# EAGLE schematic outin_shield_arduino (EAGLE 7.4.0)
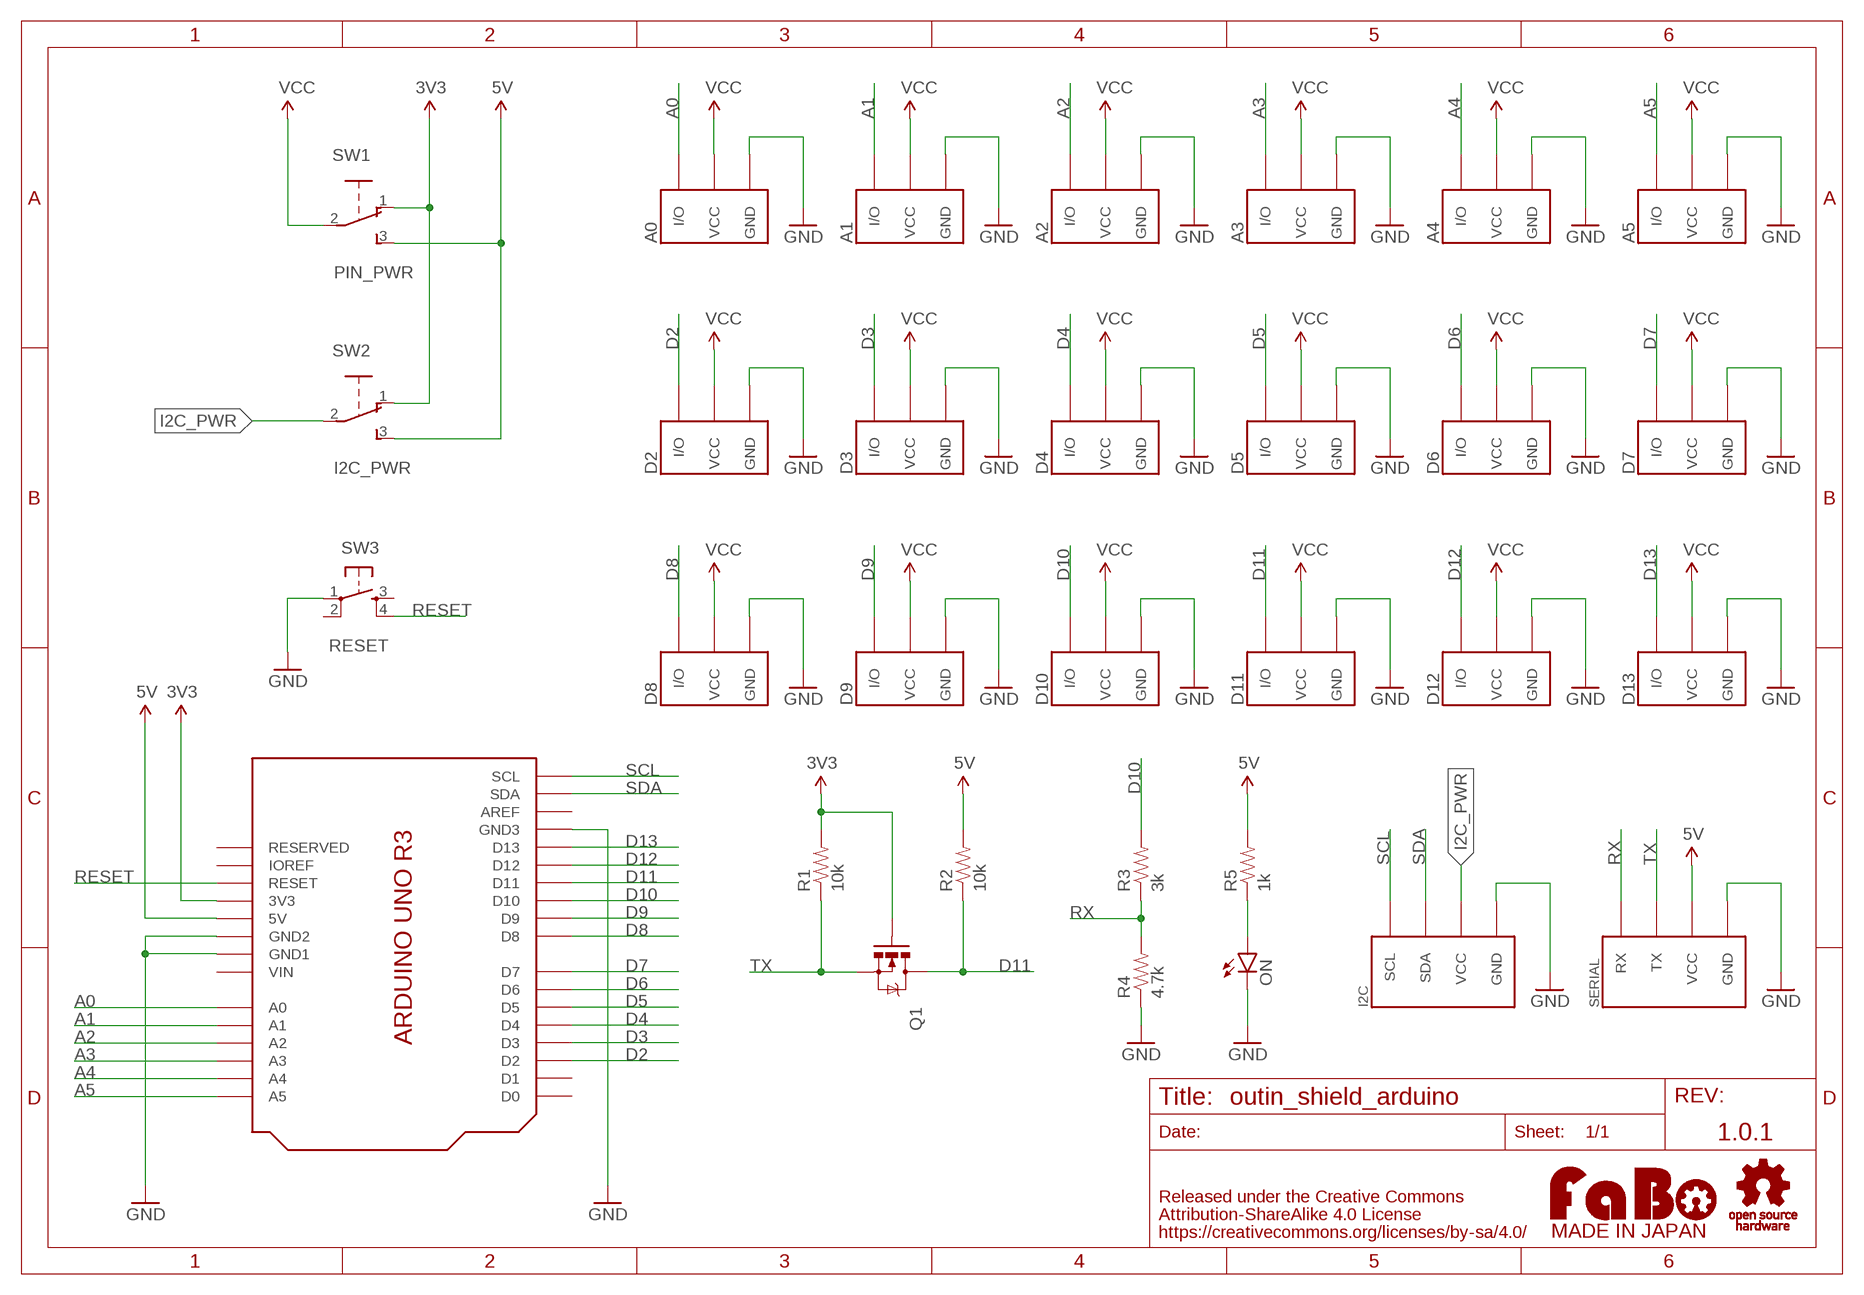
[diagram p0: schematic, sheet 1]

## Parts
A0  FABO_BRICK_3PIN-CONNECTOR  [FABO_BRICK_3PIN_CONNECTOR]
A1  FABO_BRICK_3PIN-CONNECTOR  [FABO_BRICK_3PIN_CONNECTOR]
A2  FABO_BRICK_3PIN-CONNECTOR  [FABO_BRICK_3PIN_CONNECTOR]
A3  FABO_BRICK_3PIN-CONNECTOR  [FABO_BRICK_3PIN_CONNECTOR]
A4  FABO_BRICK_3PIN-CONNECTOR  [FABO_BRICK_3PIN_CONNECTOR]
A5  FABO_BRICK_3PIN-CONNECTOR  [FABO_BRICK_3PIN_CONNECTOR]
D2  FABO_BRICK_3PIN-HEADER  [FABO_BRICK_3PIN_HEADER]
D3  FABO_BRICK_3PIN-HEADER  [FABO_BRICK_3PIN_HEADER]
D4  FABO_BRICK_3PIN-HEADER  [FABO_BRICK_3PIN_HEADER]
D5  FABO_BRICK_3PIN-HEADER  [FABO_BRICK_3PIN_HEADER]
D6  FABO_BRICK_3PIN-HEADER  [FABO_BRICK_3PIN_HEADER]
D7  FABO_BRICK_3PIN-HEADER  [FABO_BRICK_3PIN_HEADER]
D8  FABO_BRICK_3PIN-HEADER  [FABO_BRICK_3PIN_HEADER]
D9  FABO_BRICK_3PIN-HEADER  [FABO_BRICK_3PIN_HEADER]
D10  FABO_BRICK_3PIN-HEADER  [FABO_BRICK_3PIN_HEADER]
D11  FABO_BRICK_3PIN-HEADER  [FABO_BRICK_3PIN_HEADER]
D12  FABO_BRICK_3PIN-HEADER  [FABO_BRICK_3PIN_HEADER]
D13  FABO_BRICK_3PIN-HEADER  [FABO_BRICK_3PIN_HEADER]
I2C  FABO_BRICK_I2C-CONNECTOR  [FABO_BRICK_I2C_CONNECTOR]
ON  LED-EIA0603  [EIA0603-LED]
Q1  MOSFET-N-BSS138  [SOT23-3]
R1  10k  RES-EIA0603  [EIA0603]
R2  10k  RES-EIA0603  [EIA0603]
R3  3k  RES-EIA0603  [EIA0603]
R4  4.7k  RES-EIA0603  [EIA0603]
R5  1k  RES-EIA0603  [EIA0603]
SERIAL  FABO_BRICK_SERIAL-CONNECTOR  [FABO_BRICK_SERIAL_CONNECTOR]
SW1  PIN_PWR  SWITCH-SLIDE-EG1218  [EG1218]
SW2  I2C_PWR  SWITCH-SLIDE-EG1218  [EG1218]
SW3  RESET  SWITCH-TACT-6MM  [DTS_6_V]
U1  ARDUINO_UNO_R3_SHIELD-NOLABEL  [ARDUINO_UNO_R3_NOLABEL]
U$21  LOGO_FABO-M  [LOGO_FABO_M]
U$22  LOGO_OSHW-T_M_BOTTOM  [LOGO_OSHW_T_M_BOTTOM]

## Nets
3V3: Q1.1(G) R1.2 SW1.1 SW2.1 U1.3V3
5V: R2.2 R5.2 SERIAL.VCC SW1.3 SW2.3 U1.5V
A0: A0.IN/OUT(I/O) U1.A0
A1: A1.IN/OUT(I/O) U1.A1
A2: A2.IN/OUT(I/O) U1.A2
A3: A3.IN/OUT(I/O) U1.A3
A4: A4.IN/OUT(I/O) U1.A4
A5: A5.IN/OUT(I/O) U1.A5
D2: D2.I/O U1.D2
D3: D3.I/O U1.D3
D4: D4.I/O U1.D4
D5: D5.I/O U1.D5
D6: D6.I/O U1.D6
D7: D7.I/O U1.D7
D8: D8.I/O U1.D8
D9: D9.I/O U1.D9
D10: D10.I/O R3.2 U1.D10
D11: D11.I/O Q1.3(D) R2.1 U1.D11
D12: D12.I/O U1.D12
D13: D13.I/O U1.D13
GND: A0.GND A1.GND A2.GND A3.GND A4.GND A5.GND D2.GND D3.GND D4.GND D5.GND D6.GND D7.GND D8.GND D9.GND D10.GND D11.GND D12.GND D13.GND I2C.GND ON.C R4.1 SERIAL.GND SW3.1 U1.GND1 U1.GND2 U1.GND3
I2C_PWR: I2C.VCC SW2.2
LEDANO: ON.A R5.1
RESET: SW3.4 U1.RESET
RX: R3.1 R4.2 SERIAL.RX
SCL: I2C.SCL U1.SCL
SDA: I2C.SDA U1.SDA
TX: Q1.2(S) R1.1 SERIAL.TX
VCC: A0.VCC A1.VCC A2.VCC A3.VCC A4.VCC A5.VCC D2.VCC D3.VCC D4.VCC D5.VCC D6.VCC D7.VCC D8.VCC D9.VCC D10.VCC D11.VCC D12.VCC D13.VCC SW1.2
Unconnected: SW3.2 SW3.3 U1.AREF U1.D0 U1.D1 U1.IOREF U1.RESERVED

## Notes on the sheet
- 1.0.1

## Power pins joined to a net without a drawn wire
VIN: U1.VIN

## Library data of the parts
A0 A1-A5 D2-D13 = FaBo-Template:FABO_BRICK_3PIN: FaBo Brick 3pin
I2C = FaBo-Template:FABO_BRICK_I2C: FaBo Brick I2C
ON = FaBo-etc:LED: LED
Q1 = FaBo-etc:MOSFET-N
R1-R5 = FaBo-etc:RES
SERIAL = FaBo-Template:FABO_BRICK_SERIAL: FaBo Brick Serial
SW1 SW2 = FaBo-etc:SWITCH-SLIDE
SW3 = FaBo-etc:SWITCH-TACT
U1 = FaBo-Boards:ARDUINO_UNO_R3_SHIELD
U$21 = FaBo-etc:LOGO_FABO
U$22 = FaBo-etc:LOGO_OSHW